# Altium schematic sheet [07] SENSOR.SchDoc: Template
size A4; Author: Hom; CompanyName: KitSprout; DrawnBy: Hom; Engineer: Hom; Organization: KitSprout; Revision: A; SheetNumber: 6; SheetTotal: 6; Version: 0.0; LibVersion: 0.0
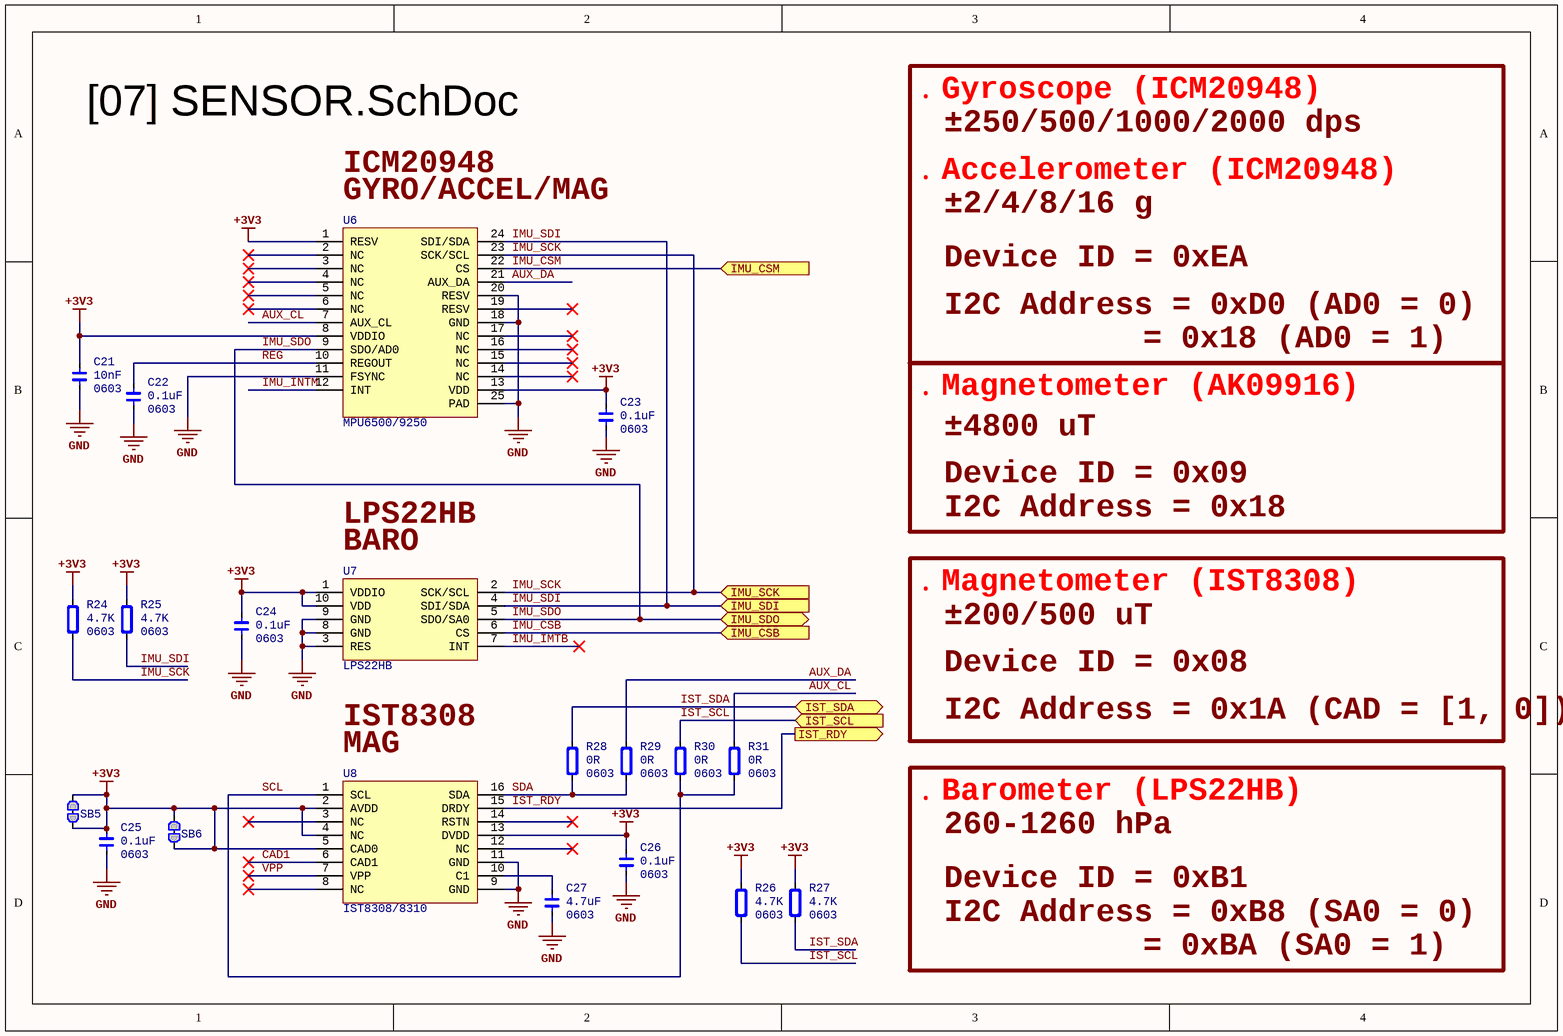
[diagram p0: [07] SENSOR.SchDoc]

## Parts
C21  Type: 0603  [CAP_0603]  (hidden comment: 10nF)
C22  Type: 0603  [CAP_0603]  (hidden comment: 0.1uF)
C23  Type: 0603  [CAP_0603]  (hidden comment: 0.1uF)
C24  Type: 0603  [CAP_0603]  (hidden comment: 0.1uF)
C25  Type: 0603  [CAP_0603]  (hidden comment: 0.1uF)
C26  Type: 0603  [CAP_0603]  (hidden comment: 0.1uF)
C27  Type: 0603  [CAP_0603]  (hidden comment: 4.7uF)
R24  Type: 0603  [RES_0603]  (hidden comment: 4.7K)
R25  Type: 0603  [RES_0603]  (hidden comment: 4.7K)
R26  Type: 0603  [RES_0603]  (hidden comment: 4.7K)
R27  Type: 0603  [RES_0603]  (hidden comment: 4.7K)
R28  Type: 0603  [RES_0603]  (hidden comment: 0R)
R29  Type: 0603  [RES_0603]  (hidden comment: 0R)
R30  Type: 0603  [RES_0603]  (hidden comment: 0R)
R31  Type: 0603  [RES_0603]  (hidden comment: 0R)
SB5  Solderbridge  [Solderbridge_Shorted]  (value not drawn)  (no BOM)
SB6  Solderbridge  [Solderbridge_Shorted]  (value not drawn)  (no BOM)
U6  MPU6500/9250  [QFN_P0.4_24]
U7  LPS22HB  [HCLGA-2x2_10]
U8  IST8308/8310  [QFN_P0.5_16]

## Ports
IMU_CSB (in), IMU_CSM (in), IMU_SCK (in), IMU_SDI (in), IMU_SDO, IST_RDY (out), IST_SCL (in), IST_SDA (bidir)

## Nets
+3V3: C21.2 C23.2 C24.2 C25.2 C26.2 R24.2 R25.2 R26.2 R27.2 SB5.1 SB5.2 SB6.1 SB6.2 U6.1(RESV) U6.8(VDDIO) U6.13(VDD) U7.1(VDDIO) U7.10(VDD) U8.2(AVDD) U8.4(NC) U8.5(CAD0) U8.13(DVDD)
GND: C21.1 C22.1 C23.1 C24.1 C25.1 C26.1 C27.1 U6.11(FSYNC) U6.18(GND) U6.20(RESV) U6.25(PAD) U7.3(RES) U7.8(GND) U7.9(GND) U8.9(GND) U8.11(GND)
AUX_CL: R31.2 U6.7(AUX_CL)
AUX_DA: R29.2 U6.21(AUX_DA)
CAD1: U8.6(CAD1)
IMU_CSB: U7.6(CS) ; port IMU_CSB
IMU_CSM: U6.22(CS) ; port IMU_CSM
IMU_IMTB: U7.7(INT)
IMU_INTM: U6.12(INT)
IMU_SCK: R24.1 U6.23(SCK/SCL) U7.2(SCK/SCL) ; port IMU_SCK
IMU_SDI: R25.1 U6.24(SDI/SDA) U7.4(SDI/SDA) ; port IMU_SDI
IMU_SDO: U6.9(SDO/AD0) U7.5(SDO/SA0) ; port IMU_SDO
IST_RDY: U8.15(DRDY) ; port IST_RDY
IST_SCL: R26.1 R30.2 ; port IST_SCL
IST_SDA: R27.1 R28.2 ; port IST_SDA
REG: C22.2 U6.10(REGOUT)
SCL: R30.1 R31.1 U8.1(SCL)
SDA: R28.1 R29.1 U8.16(SDA)
VPP: U8.7(VPP)
NetC27_2: C27.2 U8.10(C1)

Not connected (* = marked no-connect by the designer): U6 2(NC)* 3(NC)* 4(NC)* 5(NC)* 6(NC)* 14(NC)* 15(NC)* 16(NC)* 17(NC)* 19(RESV)*; U8 3(NC)* 8(NC)* 12(NC)* 14(RSTN)*

## Notes on the sheet
- ．Gyroscope (ICM20948)
- ICM20948
- ±250/500/1000/2000 dps
- (near U6) GYRO/ACCEL/MAG
- ．Accelerometer (ICM20948)
- ±2/4/8/16 g
- Device ID = 0xEA
- I2C Address = 0xD0 (AD0 = 0)
- = 0x18 (AD0 = 1)
- ．Magnetometer (AK09916)
- ±4800 uT
- I2C Address = 0x18
- Device ID = 0x09
- LPS22HB
- (near U7) BARO
- ．Magnetometer (IST8308)
- ±200/500 uT
- Device ID = 0x08
- IST8308
- (near U8) MAG
- I2C Address = 0x1A (CAD = [1, 0])
- ．Barometer (LPS22HB)
- 260-1260 hPa
- Device ID = 0xB1
- I2C Address = 0xB8 (SA0 = 0)
- = 0xBA (SA0 = 1)

## Library data of the parts
C21-C27 = Cap_0603: Capacitor
  C21: Value: 10nF
  C22-C26: Value: 0.1uF
  C27: Value: 4.7uF
R24-R31 = Res_0603: Resistor
  R24-R27: Value: 4.7K
  R28-R31: Value: 0R
SB5 SB6 = Shorted Solderbridge: Value: Solderbridge
U6 = MPU925x: Sensor Motion; Type: QFN24 P0.4
U7 = LPS22HB: Sensor Pressure; Type: LGA10 P0.5
U8 = IST8310: Sensor Magnetometer; Type: QFN16 P0.5